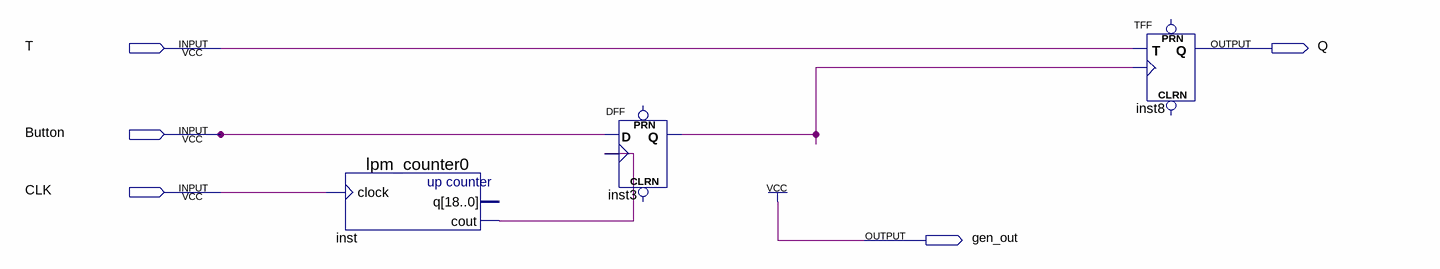
[diagram p0: schematic sheet]
// Quartus schematic 31.bdf as structural Verilog: 3 symbols, 5 pins
module \31  (
  input  T,
  input  Button,
  input  CLK,
  output Q,
  output gen_out
);

  wire inst3_q, inst_cout;

  lpm_counter0 inst (.clock(CLK), .cout(inst_cout));  // open: q
  DFF inst3 (.CLK(inst_cout), .D(Button), .Q(inst3_q));  // open: CLRN, PRN
  TFF inst8 (.T(T), .CLK(inst3_q), .Q(Q));  // open: PRN, CLRN

  assign gen_out = 1'b1;
endmodule
